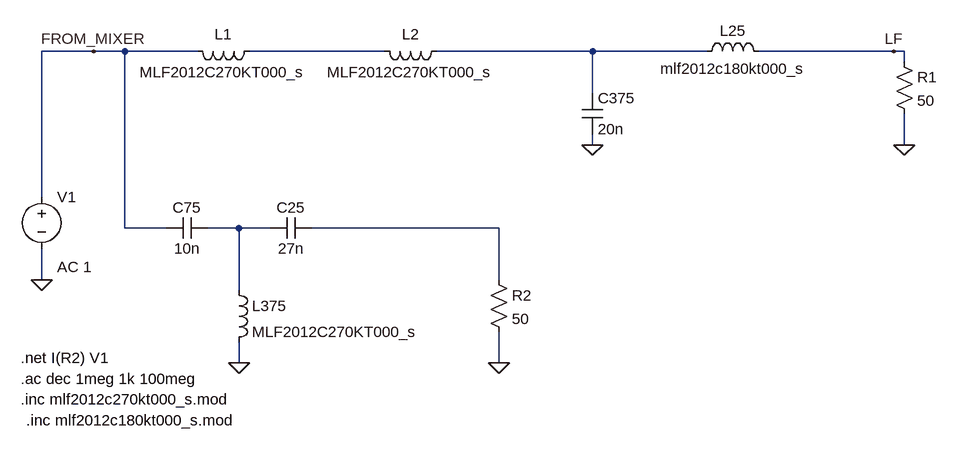
[diagram p0: schematic diplexer_LF.asc]
diplexer_LF.asc, the LTspice schematic file:
Version 4
SHEET 1 1304 680
WIRE 0 -80 -80 -80
WIRE 48 -80 0 -80
WIRE 160 -80 48 -80
WIRE 448 -80 240 -80
WIRE 768 -80 528 -80
WIRE 944 -80 768 -80
WIRE 1232 -80 1024 -80
WIRE 1248 -80 1232 -80
WIRE 1248 -64 1248 -80
WIRE 768 -16 768 -80
WIRE 768 64 768 48
WIRE 1248 64 1248 16
WIRE -80 144 -80 -80
WIRE 48 192 48 -80
WIRE 112 192 48 192
WIRE 224 192 176 192
WIRE 272 192 224 192
WIRE 624 192 336 192
WIRE -80 272 -80 224
WIRE 624 272 624 192
WIRE 224 288 224 192
WIRE 224 400 224 368
WIRE 624 400 624 352
FLAG 1248 64 0
FLAG 624 400 0
FLAG -80 272 0
FLAG 768 64 0
FLAG 224 400 0
FLAG 1232 -80 LF
FLAG 0 -80 FROM_MIXER
SYMBOL voltage -80 128 R0
WINDOW 123 24 124 Left 2
WINDOW 39 0 0 Left 0
SYMATTR Value2 AC 1
SYMATTR InstName V1
SYMATTR Value ""
SYMBOL ind 928 -64 R270
WINDOW 0 32 56 VTop 2
WINDOW 3 5 56 VBottom 2
SYMATTR InstName L25
SYMATTR Value mlf2012c180kt000_s
SYMATTR Prefix X
SYMBOL cap 752 -16 R0
SYMATTR InstName C375
SYMATTR Value 20n
SYMBOL cap 176 176 R90
WINDOW 0 0 32 VBottom 2
WINDOW 3 32 32 VTop 2
SYMATTR InstName C75
SYMATTR Value 10n
SYMBOL cap 336 176 R90
WINDOW 0 0 32 VBottom 2
WINDOW 3 32 32 VTop 2
SYMATTR InstName C25
SYMATTR Value 27n
SYMBOL ind 208 272 R0
SYMATTR InstName L375
SYMATTR Value MLF2012C270KT000_s
SYMATTR Prefix X
SYMBOL res 1232 -80 R0
SYMATTR InstName R1
SYMATTR Value 50
SYMBOL res 608 256 R0
SYMATTR InstName R2
SYMATTR Value 50
SYMBOL ind 256 -96 R90
WINDOW 0 5 56 VBottom 2
WINDOW 3 32 56 VTop 2
SYMATTR InstName L1
SYMATTR Value MLF2012C270KT000_s
SYMATTR Prefix X
SYMBOL ind 544 -96 R90
WINDOW 0 5 56 VBottom 2
WINDOW 3 32 56 VTop 2
SYMATTR InstName L2
SYMATTR Value MLF2012C270KT000_s
SYMATTR Prefix X
TEXT -112 392 Left 2 !.net I(R2) V1
TEXT -112 424 Left 2 !.ac dec 1meg 1k 100meg
TEXT -112 456 Left 2 !.inc mlf2012c270kt000_s.mod
TEXT -104 488 Left 2 !.inc mlf2012c180kt000_s.mod

The netlist it stands for:
* diplexer_LF.asc
V1 FROM_MIXER 0 AC 1
XL25 N002 LF mlf2012c180kt000_s  ; pins A B
C375 N002 0 20n
C75 N003 FROM_MIXER 10n
C25 N004 N003 27n
XL375 N003 0 MLF2012C270KT000_s  ; pins A B
R1 LF 0 50
R2 N004 0 50
XL1 N001 FROM_MIXER MLF2012C270KT000_s  ; pins A B
XL2 N002 N001 MLF2012C270KT000_s  ; pins A B
.net I(R2) V1
.ac dec 1meg 1k 100meg
.inc mlf2012c270kt000_s.mod
.inc mlf2012c180kt000_s.mod
.backanno
.end